# Altium schematic sheet A4_INSAGE_01.SchDoc: NUCLEO / IHM
size A4; Author: INSA GE; Organization: INSA de Lyon; Address1: Département Génie Électrique; Address2: Bâtiment Gustave Ferrié; Address3: 8, Rue de la Physique; Address4: 69621 VILLEURBANNE CEDEX; Revision: 1.2; SheetNumber: 1; SheetTotal: 3
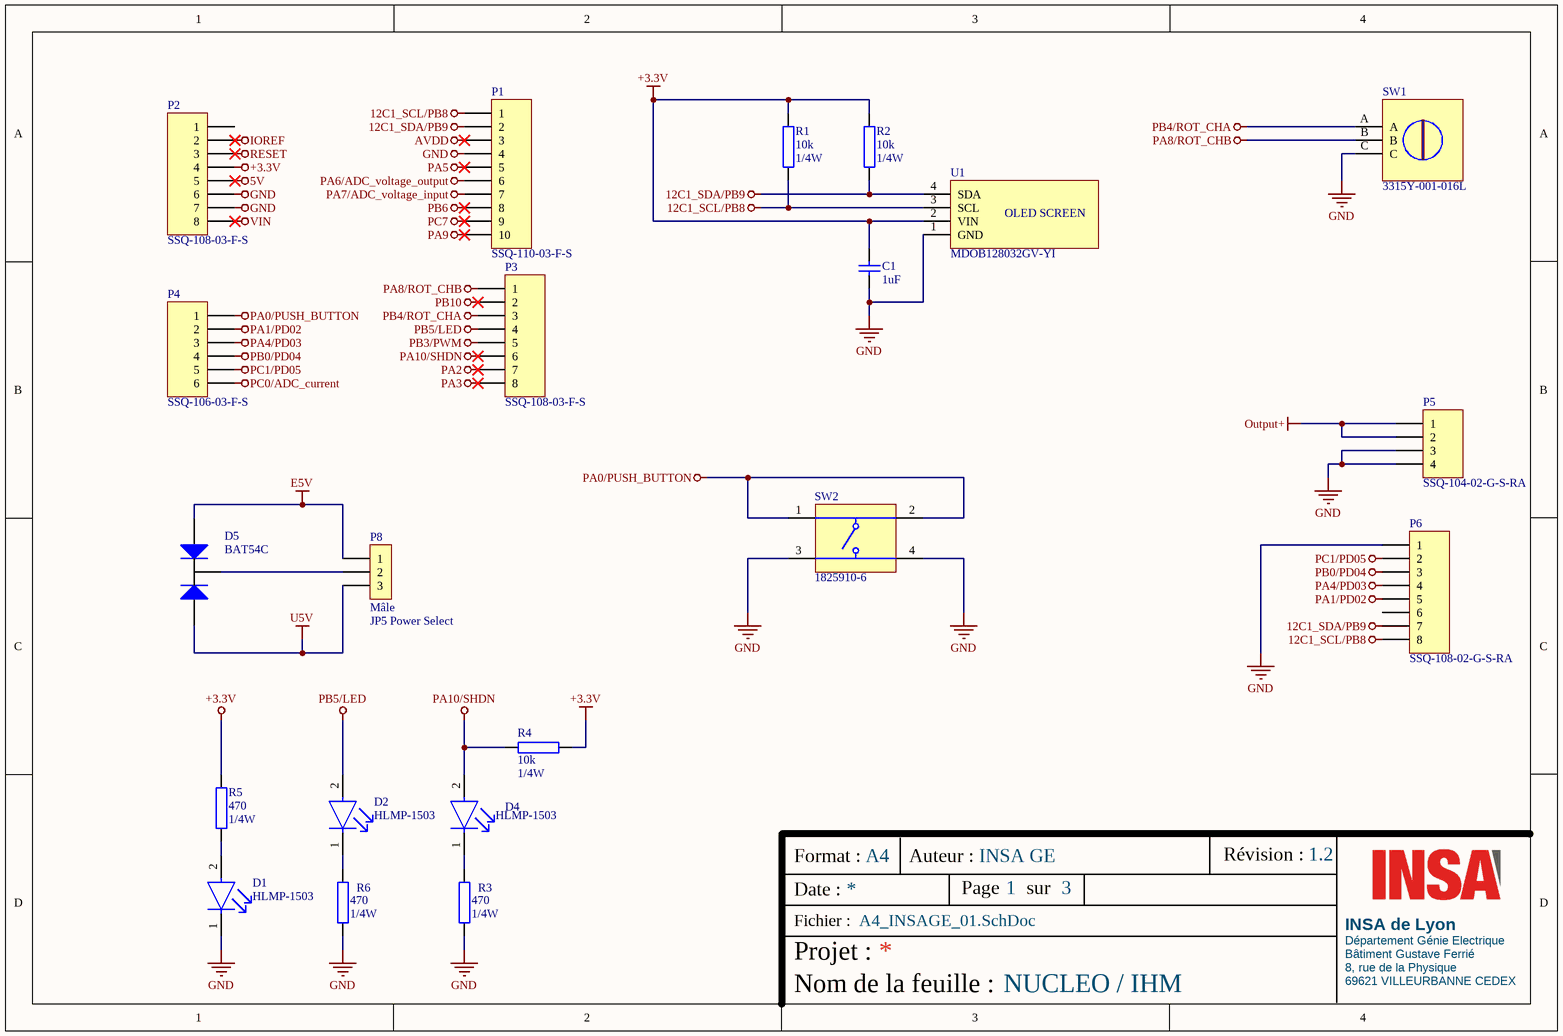
[diagram p0: A4_INSAGE_01.SchDoc]

## Parts
C1  value 1uF  [1206_C]  (hidden comment: Condensateur NON pol)
D1  HLMP-1503  [FP-HLMP-1503-MFG]
D2  HLMP-1503  [FP-HLMP-1503-MFG]
D4  HLMP-1503  [FP-HLMP-1503-MFG]
D5  BAT54C  [SOT-23-3]
P1  SSQ-110-03-F-S  [ARDUINO HDR1X10]
P2  SSQ-108-03-F-S  [ARDUINO HDR1X8]
P3  SSQ-108-03-F-S  [ARDUINO HDR1X8]
P4  SSQ-106-03-F-S  [ARDUINO HDR1X6]
P5  SSQ-104-02-G-S-RA  [ARDUINO HDR1X4 - Coudé]
P6  SSQ-108-02-G-S-RA  [ARDUINO HDR1X8 - Coudé]
P8  JP5 Power Select  [3PINF100]
R1  value 10k  Puissance: 1/4W  [1206_R]  (hidden comment: Resistance)
R2  value 10k  Puissance: 1/4W  [1206_R]  (hidden comment: Resistance)
R3  value 470  Puissance: 1/4W  [1206_R]  (hidden comment: Resistance)
R4  value 10k  Puissance: 1/4W  [1206_R]  (hidden comment: Resistance)
R5  value 470  Puissance: 1/4W  [1206_R]  (hidden comment: Resistance)
R6  value 470  Puissance: 1/4W  [1206_R]  (hidden comment: Resistance)
SW1  3315Y-001-016L  [ROTARY]
SW2  1825910-6  [TECO-1825910-6_V]
U1  MDOB128032GV-YI  [MDOB128032GV-YI]

## Nets
5V: P2.5
12C1_SCL/PB8: P1.1 P6.8 R1.1 U1.3(SCL)
12C1_SDA/PB9: P1.2 P6.7 R2.1 U1.4(SDA)
+3.3V: C1.2 P2.4 R1.2 R2.2 R4.2 R5.2 U1.2(VIN)
AVDD: P1.3
E5V: D5.1(A1) P8.1
GND: C1.1 D1.1(C) P1.4 P2.6 P2.7 P5.3 P5.4 P6.1 R3.1 R6.1 SW1.C SW2.3 SW2.4 U1.1(GND)
IOREF: P2.2
Output+: P5.1 P5.2
PA0/PUSH_BUTTON: P4.1 SW2.1 SW2.2
PA1/PD02: P4.2 P6.5
PA2: P3.7
PA3: P3.8
PA4/PD03: P4.3 P6.4
PA5: P1.5
PA6/ADC_voltage_output: P1.6
PA7/ADC_voltage_input: P1.7
PA8/ROT_CHB: P3.1 SW1.B
PA9: P1.10
PA10/SHDN: D4.2(A) P3.6 R4.1
PB0/PD04: P4.4 P6.3
PB3/PWM: P3.5
PB4/ROT_CHA: P3.3 SW1.A
PB5/LED: D2.2(A) P3.4
PB6: P1.8
PB10: P3.2
PC0/ADC_current: P4.6
PC1/PD05: P4.5 P6.2
PC7: P1.9
RESET: P2.3
U5V: D5.2(A2) P8.3
VIN: P2.8
NetD1_2: D1.2(A) R5.1
NetD2_1: D2.1(C) R6.2
NetD4_1: D4.1(C) R3.2
NetD5_3: D5.3(K) P8.2

Not connected (* = marked no-connect by the designer): P2 1; P6 6

## Notes on the sheet
- Format :
- Date :
- A4
- Auteur :
- Page
- sur
- Révision :
- Projet :
- Fichier :
- INSA de Lyon
- Département Génie Electrique
- 8, rue de la Physique
- 69621 VILLEURBANNE CEDEX
- Nom de la feuille :
- (in symbol BarF100Mil3Con1R) Mâle
- (in symbol SCREEN MDOB128032GV-YI) OLED SCREEN

## Library data of the parts
D1 D2 D4 = CMP-18399-000010-1: LED GREEN DIFFUSED T-1 T/H; Manufacturer: Broadcom; Reverse Voltage: 5V; Wavelength: 569nm; Forward Voltage: 2.1V; Led Orientation: Straight; Viewing Angle: 60°; Max Junction Temp: +110°C; Peak Emmision Wavelength: 565nm; Luminous Intensity: 1mcd; Standoff Height: 0.88mm; Forward Current: 10mA; Mouser Description: LED; Green; 1mcd; 0.115In.Dia.; T-1; 565nm; 25mA; 2.1V; 5V; GaP; -20degC; 100deg; ComponentLink2Description: Datasheet; Digikey Description: LED GREEN DIFFUSED T-1 T/H; Device Class L1: Optoelectronics; Device Class L3: unset; Automotive: No; Device Class L2: LEDs; Manufacturer Part Number: HLMP-1503; Category: Diode; Temperature Range Low: -20°C; Height: 6.35mm; RoHS: TRUE; Octopart: https://octopart.com/hlmp-1503-broadcom-71130371; Temperature: -20°C to +100°C; Lead Free: Yes; ComponentLink2URL: https://docs.broadcom.com/docs/AV02-1555EN; Package: HLMP-1503; Colour: Green; Temperature Range High: +100°C
D5 = BAT54C: Double Small signal Schottky diodes
P1 = Header 10: CONN RCPT 10POS 0.1 GOLD PCB; LatestRevisionDate: 17-Jul-2002; LatestRevisionNote: Re-released for DXP Platform.; Publisher: Altium Limited
P2 P3 = Header 8: CONN RCPT 8POS 0.1 GOLD PCB; LatestRevisionDate: 17-Jul-2002; LatestRevisionNote: Re-released for DXP Platform.; Publisher: Altium Limited
P4 = Header 6: CONN RCPT 6POS 0.1 GOLD PCB; LatestRevisionDate: 17-Jul-2002; LatestRevisionNote: Re-released for DXP Platform.; Publisher: Altium Limited
P5 = Header 4 Coudé: LatestRevisionDate: 17-Jul-2002; LatestRevisionNote: Re-released for DXP Platform.; Publisher: Altium Limited
P6 = Header 8 Coudé: LatestRevisionDate: 17-Jul-2002; LatestRevisionNote: Re-released for DXP Platform.; Publisher: Altium Limited
P8 = BarF100Mil3Con1R: Barrette femelle 100mil 3 PIN 1 rangée; LatestRevisionDate: 17-Jul-2002; LatestRevisionNote: Re-released for DXP Platform.; Publisher: Altium Limited
R1-R6 = Resistance: Resistor; Published: 8-Jun-2000; LatestRevisionDate: 29-May-2009; LatestRevisionNote: IPC-7351 Footprint Added.; PackageReference: J1-0603; Publisher: Altium Limited; PackageDescription: Chip Resistor
SW1 = ROT ENCODER 3315Y-025-016L: ROTARY ENCODER MECHANICAL 16PPR
SW2 = CMP-1684-00021-1: SWITCH TACTILE SPST-NO 0.05A 24V; Manufacturer: TE Connectivity; Maximum Contact Resistance: 100mOhm; Mechanical Life: 100000Cycles; Bushing Type: Unthreaded; Switch Configuration: OFF(ON); Contact Rating @ Voltage: 0.05A@24VDC; Actuator Color: Black; Body Orientation: Straight; Function: MomentaryContact; Illumination: N/R; Actuator Style: RoundButton; Actuator Material: PolybutyleneTerephthalate; Dielectric Strength: 500VAC; Pole Throw Configuration: SPST; Actuator Length: 1.4mm; Product Weight: N/A; Contact Material: CopperAlloy; Housing Material: N/A; Terminal Type: PCPins; Minimum Insulation Resistance: 100MOhm; Maximum DC Voltage Rating: 24V; Package Description: 4-Pin Through Hole Device, Body 5.99 x 5.99 mm, Pitch 6.5 mm; Part No: 1825910-6; Package Reference: THD; Base Material: N/A; Manufacturer URL: http://www.te.com; Contact Plating: Silver; RoHS: Yes; Datasheet Version: Rev. C9; Electrical Life: 100000Cycles; Maximum AC Voltage Rating: N/A; Thread Size: N/R; Operating Temperature: -35to85C; Mounting: ThroughHole; Dimension: 5.99x5mm; Datasheet URL: http://www.te.com/commerce/DocumentDelivery/DDEController?Action=showdoc&DocId=Customer+Drawing%7F1825910%7FC9%7Fpdf%7FEnglish%7FENG_CD_1825910_C9.pdf%7F1825910-6; Family: 1825910; Seal Location: N/A; Seal Description: N/A; Packaging: N/A
U1 = SCREEN MDOB128032GV-YI: GRAPHIC OLED 128x32 YELLOW 3V I2C
C1 = Condensateur NON pol: Published: 8-Jun-2000; LatestRevisionDate: 29-May-2009; LatestRevisionNote: IPC-7351 Footprint Added.; PackageReference: C1206; Publisher: Altium Limited; PackageDescription: Chip Capacitor